# EAGLE schematic RPi_Extension_weight (EAGLE 7.6.0)
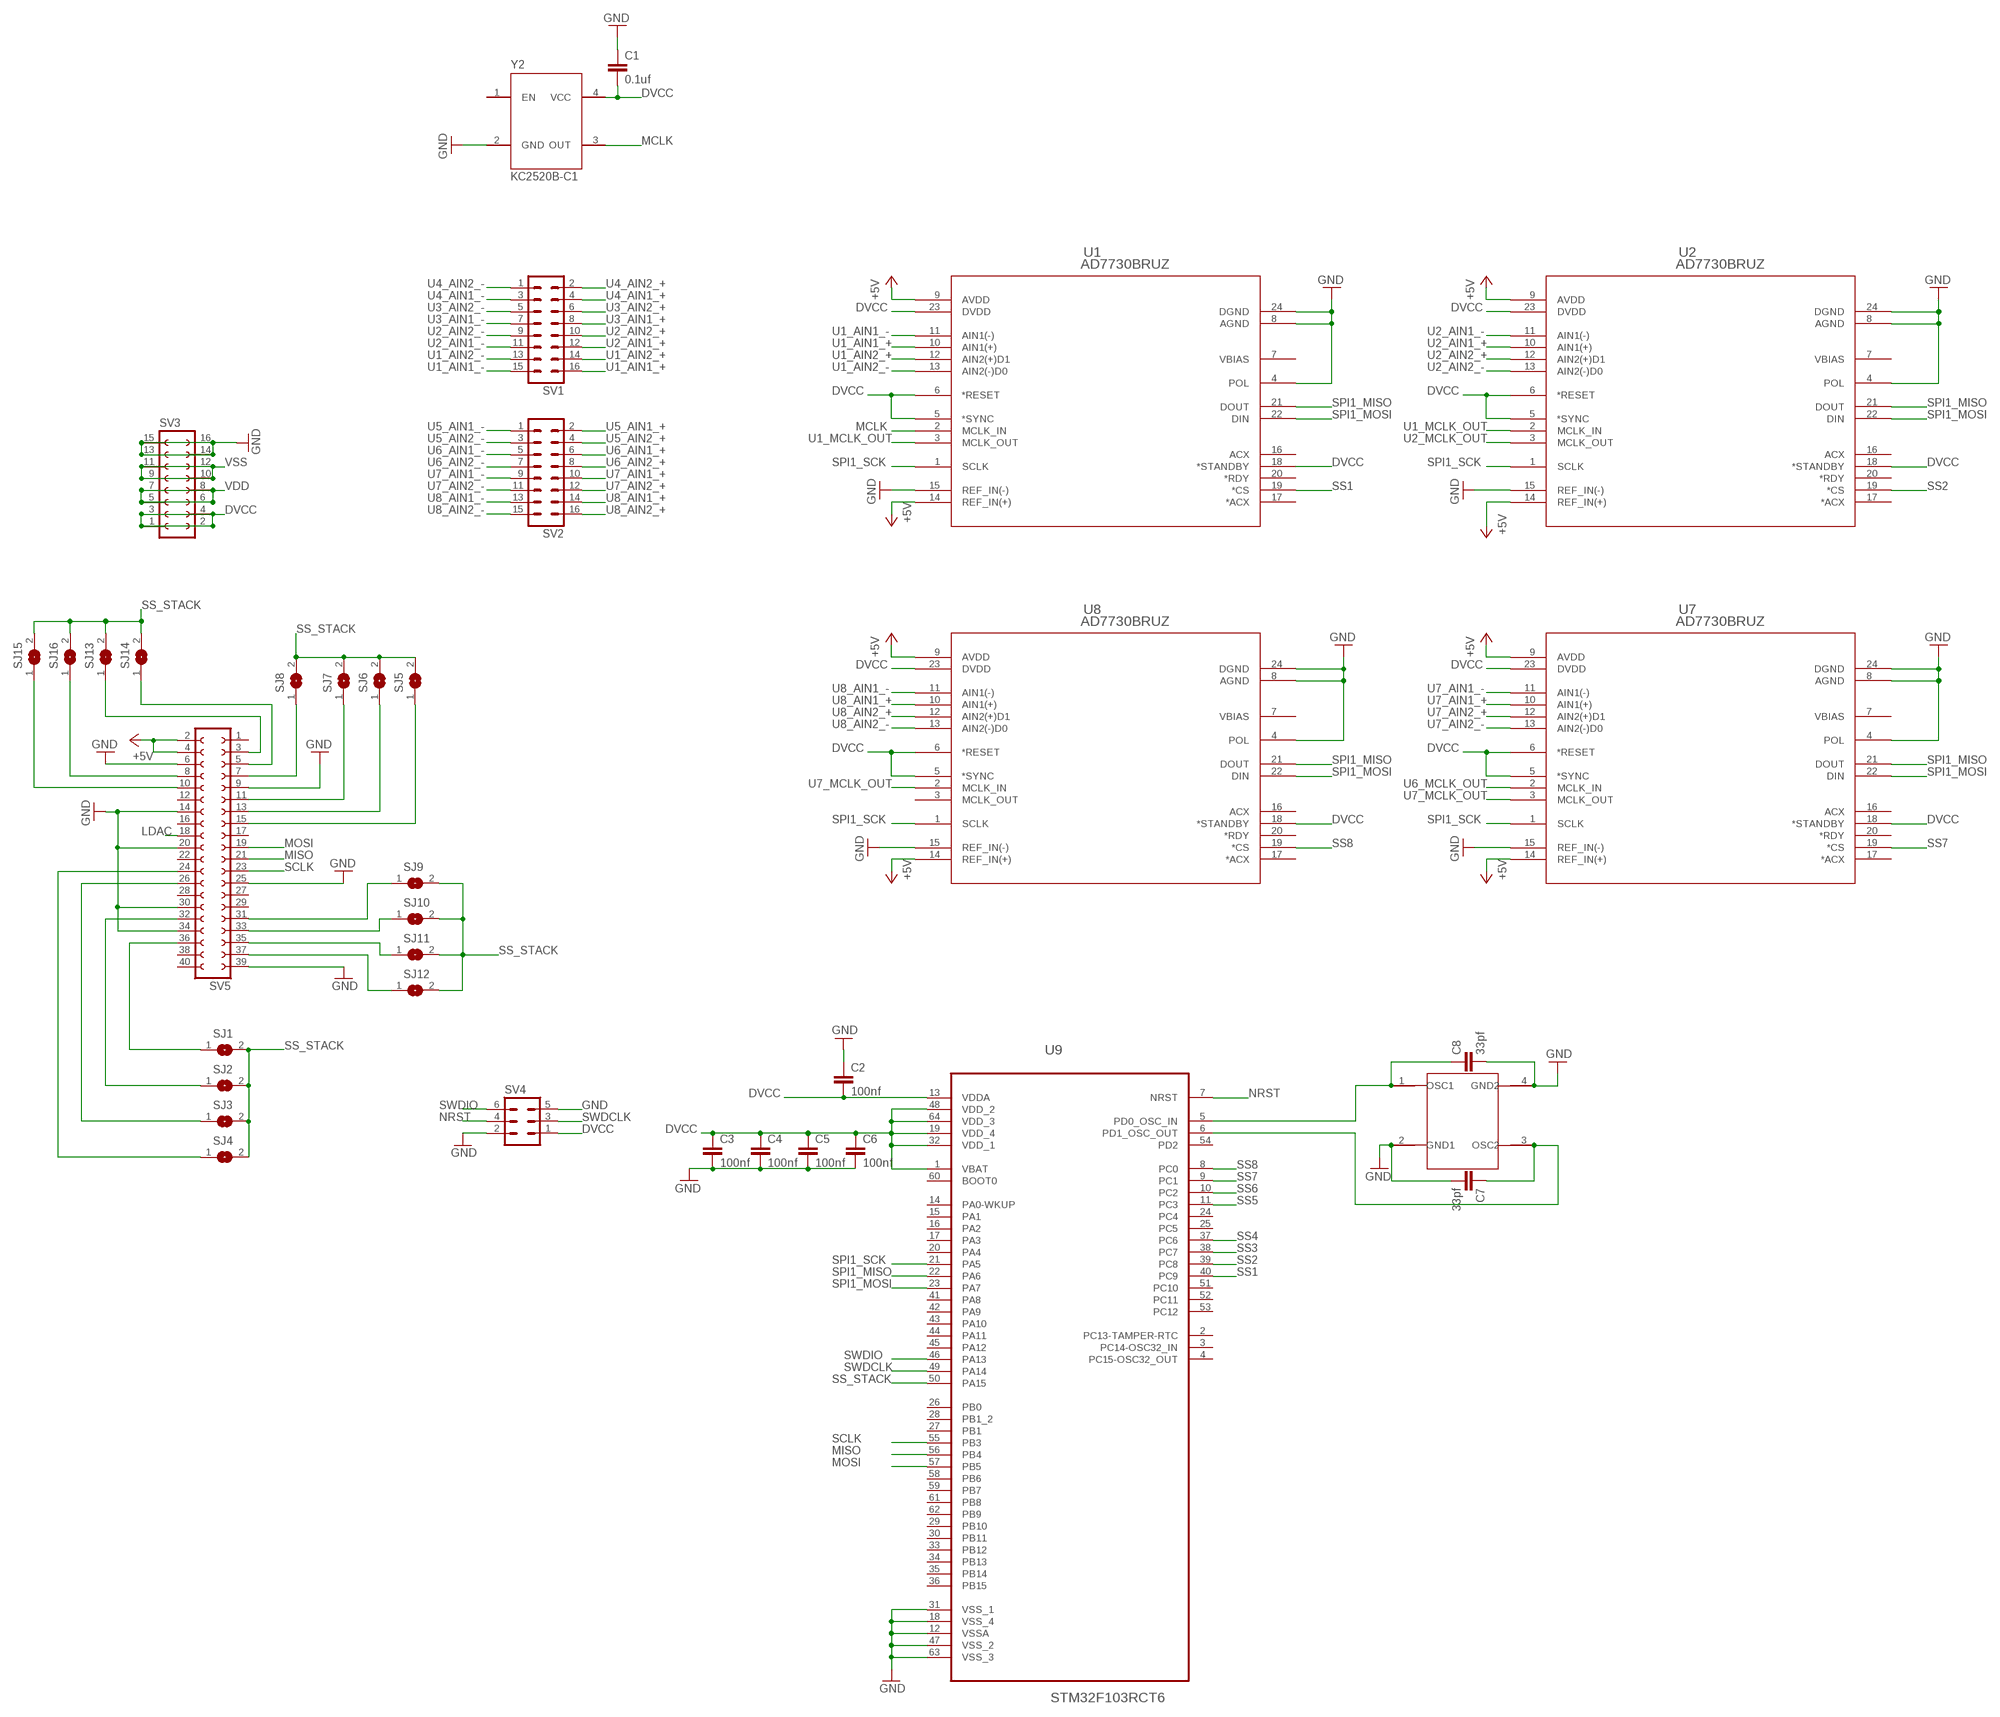
[diagram p0: schematic, sheet 1, part 1 of 2]
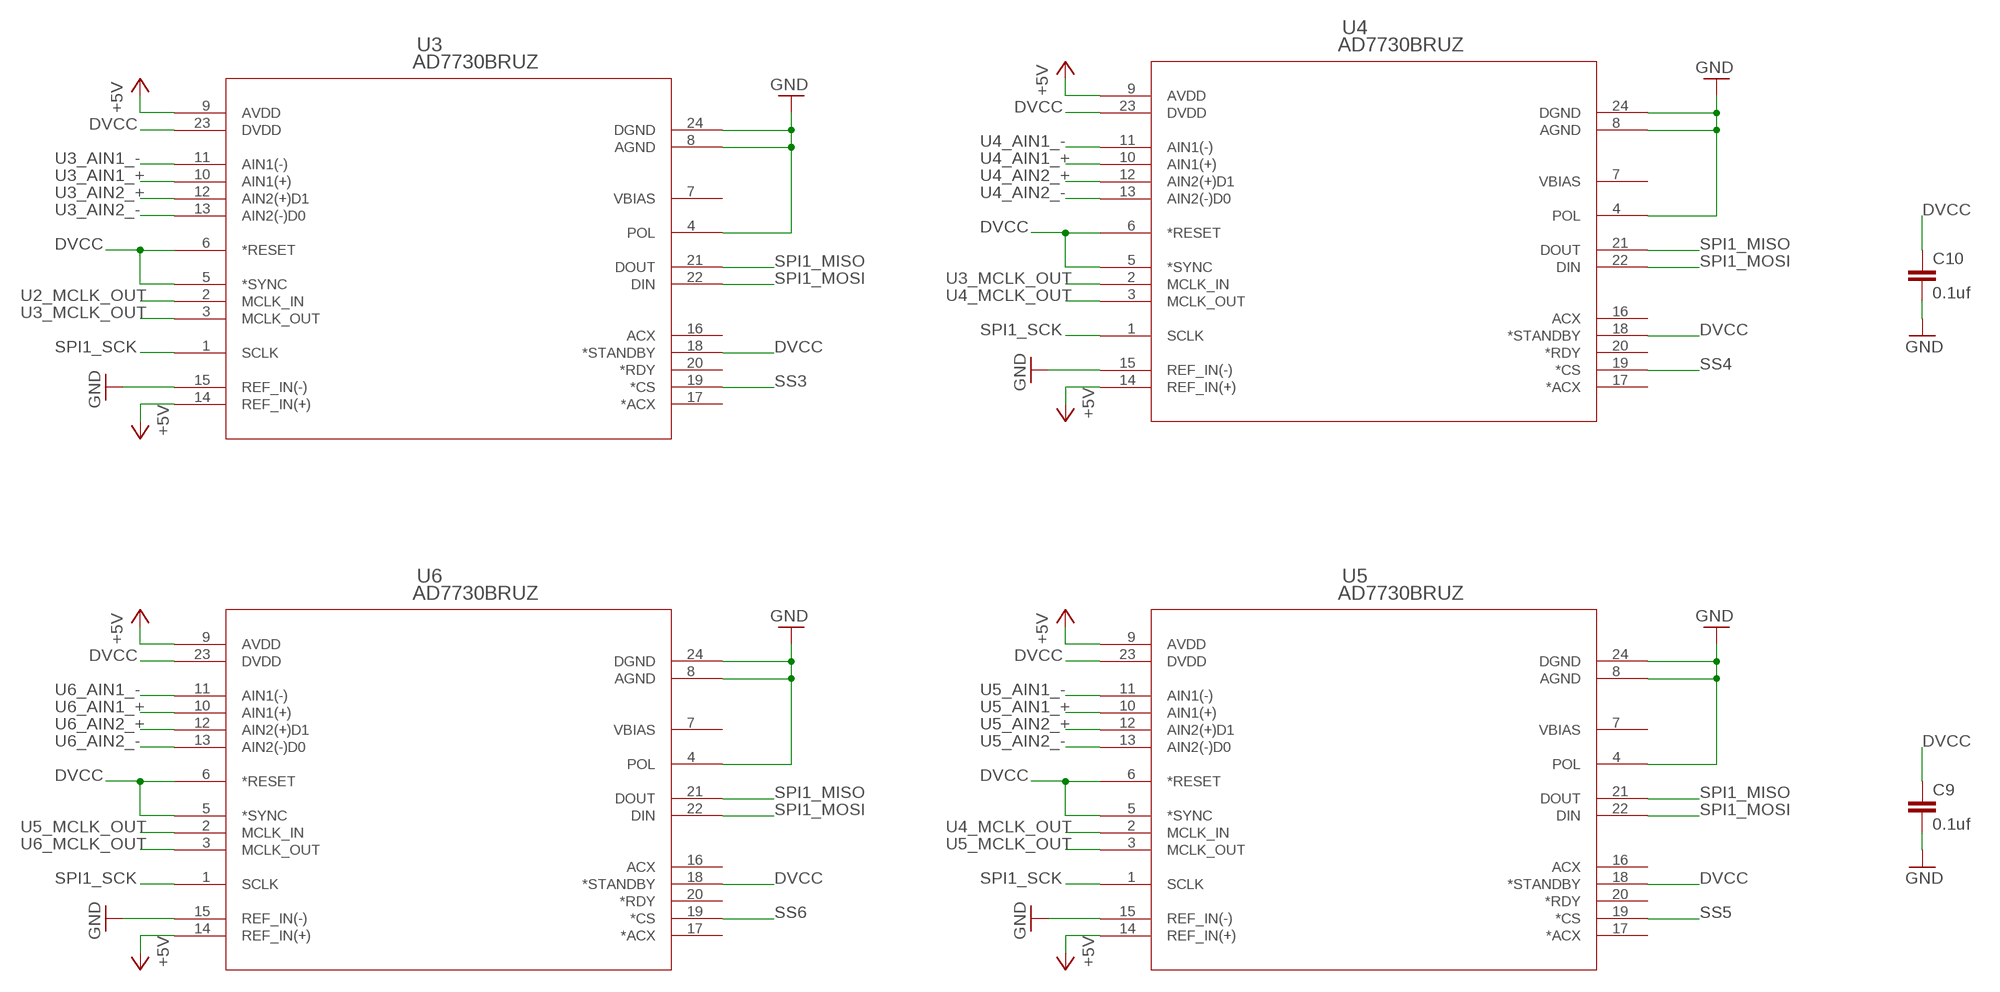
[diagram p1: schematic, sheet 1, part 2 of 2]

## Parts
C1  0.1uf  C-EUC0603  [C0603]
C2  100nf  C-EUC0603  [C0603]
C3  100nf  C-EUC0603  [C0603]
C4  100nf  C-EUC0603  [C0603]
C5  100nf  C-EUC0603  [C0603]
C6  100nf  C-EUC0603  [C0603]
C7  33pf  C-EUC0603  [C0603]
C8  33pf  C-EUC0603  [C0603]
C9  0.1uf  C-EUC0603  [C0603]
C10  0.1uf  C-EUC0603  [C0603]
SJ1  SJ  [SJ]
SJ2  SJ  [SJ]
SJ3  SJ  [SJ]
SJ4  SJ  [SJ]
SJ5  SJ  [SJ]
SJ6  SJ  [SJ]
SJ7  SJ  [SJ]
SJ8  SJ  [SJ]
SJ9  SJ  [SJ]
SJ10  SJ  [SJ]
SJ11  SJ  [SJ]
SJ12  SJ  [SJ]
SJ13  SJ  [SJ]
SJ14  SJ  [SJ]
SJ15  SJ  [SJ]
SJ16  SJ  [SJ]
SV1  MA08-2W  [MA08-2W]
SV2  MA08-2W  [MA08-2W]
SV3  FE08-2  [FE08-2]
SV4  MA03-2  [MA03-2]
SV5  FE20-2  [FE20-2]
U1  AD7730BRUZ  [RU_24]
U2  AD7730BRUZ  [RU_24]
U3  AD7730BRUZ  [RU_24]
U4  AD7730BRUZ  [RU_24]
U5  AD7730BRUZ  [RU_24]
U6  AD7730BRUZ  [RU_24]
U7  AD7730BRUZ  [RU_24]
U8  AD7730BRUZ  [RU_24]
U9  STM32F103RCT6  [QFP50P1200X1200X160-64N]
Y1  ABM3B  [ABM3B]
Y2  KC2520B-C1  [KC2520B-C1]

## Nets
+5V: SV5.2 SV5.4 U1.9(AVDD) U1.14(REF_IN(+)) U2.9(AVDD) U2.14(REF_IN(+)) U3.9(AVDD) U3.14(REF_IN(+)) U4.9(AVDD) U4.14(REF_IN(+)) U5.9(AVDD) U5.14(REF_IN(+)) U6.9(AVDD) U6.14(REF_IN(+)) U7.9(AVDD) U7.14(REF_IN(+)) U8.9(AVDD) U8.14(REF_IN(+))
DVCC: C1.2 C2.2 C3.1 C4.1 C5.1 C6.1 C9.1 C10.1 SV3.1 SV3.2 SV3.3 SV3.4 SV4.1 U1.5(*SYNC) U1.6(*RESET) U1.18(*STANDBY) U1.23(DVDD) U2.5(*SYNC) U2.6(*RESET) U2.18(*STANDBY) U2.23(DVDD) U3.5(*SYNC) U3.6(*RESET) U3.18(*STANDBY) U3.23(DVDD) U4.5(*SYNC) U4.6(*RESET) U4.18(*STANDBY) U4.23(DVDD) U5.5(*SYNC) U5.6(*RESET) U5.18(*STANDBY) U5.23(DVDD) U6.5(*SYNC) U6.6(*RESET) U6.18(*STANDBY) U6.23(DVDD) U7.5(*SYNC) U7.6(*RESET) U7.18(*STANDBY) U7.23(DVDD) U8.5(*SYNC) U8.6(*RESET) U8.18(*STANDBY) U8.23(DVDD) U9.1(VBAT) U9.13(VDDA) U9.19(VDD_4) U9.32(VDD_1) U9.48(VDD_2) U9.64(VDD_3) Y2.4(VCC)
GND: C1.1 C2.1 C3.2 C4.2 C5.2 C6.2 C7.2 C8.2 C9.2 C10.2 SV3.13 SV3.14 SV3.15 SV3.16 SV4.2 SV4.5 SV5.6 SV5.9 SV5.14 SV5.20 SV5.25 SV5.30 SV5.34 SV5.39 U1.4(POL) U1.8(AGND) U1.15(REF_IN(-)) U1.24(DGND) U2.4(POL) U2.8(AGND) U2.15(REF_IN(-)) U2.24(DGND) U3.4(POL) U3.8(AGND) U3.15(REF_IN(-)) U3.24(DGND) U4.4(POL) U4.8(AGND) U4.15(REF_IN(-)) U4.24(DGND) U5.4(POL) U5.8(AGND) U5.15(REF_IN(-)) U5.24(DGND) U6.4(POL) U6.8(AGND) U6.15(REF_IN(-)) U6.24(DGND) U7.4(POL) U7.8(AGND) U7.15(REF_IN(-)) U7.24(DGND) U8.4(POL) U8.8(AGND) U8.15(REF_IN(-)) U8.24(DGND) U9.12(VSSA) U9.18(VSS_4) U9.31(VSS_1) U9.47(VSS_2) U9.63(VSS_3) Y1.2(GND1) Y1.4(GND2) Y2.2(GND)
LDAC: SV5.18
MCLK: U1.2(MCLK_IN) Y2.3(OUT)
MISO: SV5.21 U9.56(PB4)
MOSI: SV5.19 U9.57(PB5)
N$1: SJ12.1 SV5.37
N$2: C8.1 U9.5(PD0_OSC_IN) Y1.1(OSC1)
N$3: C7.1 U9.6(PD1_OSC_OUT) Y1.3(OSC2)
N$4: SJ11.1 SV5.35
N$5: SJ10.1 SV5.33
N$6: SJ9.1 SV5.31
N$7: SJ16.1 SV5.8
N$8: SJ15.1 SV5.10
N$9: SJ13.1 SV5.3
N$10: SJ14.1 SV5.5
N$20: SJ1.1 SV5.36
N$21: SJ8.1 SV5.7
N$22: SJ2.1 SV5.32
N$23: SJ3.1 SV5.26
N$24: SJ4.1 SV5.24
N$25: SJ7.1 SV5.11
N$26: SJ6.1 SV5.13
N$27: SJ5.1 SV5.15
NRST: SV4.4 U9.7(NRST)
SCLK: SV5.23 U9.55(PB3)
SPI1_MISO: U1.21(DOUT) U2.21(DOUT) U3.21(DOUT) U4.21(DOUT) U5.21(DOUT) U6.21(DOUT) U7.21(DOUT) U8.21(DOUT) U9.22(PA6)
SPI1_MOSI: U1.22(DIN) U2.22(DIN) U3.22(DIN) U4.22(DIN) U5.22(DIN) U6.22(DIN) U7.22(DIN) U8.22(DIN) U9.23(PA7)
SPI1_SCK: U1.1(SCLK) U2.1(SCLK) U3.1(SCLK) U4.1(SCLK) U5.1(SCLK) U6.1(SCLK) U7.1(SCLK) U8.1(SCLK) U9.21(PA5)
SS1: U1.19(*CS) U9.40(PC9)
SS2: U2.19(*CS) U9.39(PC8)
SS3: U3.19(*CS) U9.38(PC7)
SS4: U4.19(*CS) U9.37(PC6)
SS5: U5.19(*CS) U9.11(PC3)
SS6: U6.19(*CS) U9.10(PC2)
SS7: U7.19(*CS) U9.9(PC1)
SS8: U8.19(*CS) U9.8(PC0)
SS_STACK: SJ1.2 SJ2.2 SJ3.2 SJ4.2 SJ5.2 SJ6.2 SJ7.2 SJ8.2 SJ9.2 SJ10.2 SJ11.2 SJ12.2 SJ13.2 SJ14.2 SJ15.2 SJ16.2 U9.50(PA15)
SWDCLK: SV4.3 U9.49(PA14)
SWDIO: SV4.6 U9.46(PA13)
U1_AIN1_+: SV1.16 U1.10(AIN1(+))
U1_AIN1_-: SV1.15 U1.11(AIN1(-))
U1_AIN2_+: SV1.14 U1.12(AIN2(+)D1)
U1_AIN2_-: SV1.13 U1.13(AIN2(-)D0)
U1_MCLK_OUT: U1.3(MCLK_OUT) U2.2(MCLK_IN)
U2_AIN1_+: SV1.12 U2.10(AIN1(+))
U2_AIN1_-: SV1.11 U2.11(AIN1(-))
U2_AIN2_+: SV1.10 U2.12(AIN2(+)D1)
U2_AIN2_-: SV1.9 U2.13(AIN2(-)D0)
U2_MCLK_OUT: U2.3(MCLK_OUT) U3.2(MCLK_IN)
U3_AIN1_+: SV1.8 U3.10(AIN1(+))
U3_AIN1_-: SV1.7 U3.11(AIN1(-))
U3_AIN2_+: SV1.6 U3.12(AIN2(+)D1)
U3_AIN2_-: SV1.5 U3.13(AIN2(-)D0)
U3_MCLK_OUT: U3.3(MCLK_OUT) U4.2(MCLK_IN)
U4_AIN1_+: SV1.4 U4.10(AIN1(+))
U4_AIN1_-: SV1.3 U4.11(AIN1(-))
U4_AIN2_+: SV1.2 U4.12(AIN2(+)D1)
U4_AIN2_-: SV1.1 U4.13(AIN2(-)D0)
U4_MCLK_OUT: U4.3(MCLK_OUT) U5.2(MCLK_IN)
U5_AIN1_+: SV2.2 U5.10(AIN1(+))
U5_AIN1_-: SV2.1 U5.11(AIN1(-))
U5_AIN2_+: SV2.4 U5.12(AIN2(+)D1)
U5_AIN2_-: SV2.3 U5.13(AIN2(-)D0)
U5_MCLK_OUT: U5.3(MCLK_OUT) U6.2(MCLK_IN)
U6_AIN1_+: SV2.6 U6.10(AIN1(+))
U6_AIN1_-: SV2.5 U6.11(AIN1(-))
U6_AIN2_+: SV2.8 U6.12(AIN2(+)D1)
U6_AIN2_-: SV2.7 U6.13(AIN2(-)D0)
U6_MCLK_OUT: U6.3(MCLK_OUT) U7.2(MCLK_IN)
U7_AIN1_+: SV2.10 U7.10(AIN1(+))
U7_AIN1_-: SV2.9 U7.11(AIN1(-))
U7_AIN2_+: SV2.12 U7.12(AIN2(+)D1)
U7_AIN2_-: SV2.11 U7.13(AIN2(-)D0)
U7_MCLK_OUT: U7.3(MCLK_OUT) U8.2(MCLK_IN)
U8_AIN1_+: SV2.14 U8.10(AIN1(+))
U8_AIN1_-: SV2.13 U8.11(AIN1(-))
U8_AIN2_+: SV2.16 U8.12(AIN2(+)D1)
U8_AIN2_-: SV2.15 U8.13(AIN2(-)D0)
VDD: SV3.5 SV3.6 SV3.7 SV3.8
VSS: SV3.9 SV3.10 SV3.11 SV3.12
Unconnected: SV5.1 SV5.12 SV5.16 SV5.17 SV5.22 SV5.27 SV5.28 SV5.29 SV5.38 SV5.40 U1.7(VBIAS) U1.16(ACX) U1.17(*ACX) U1.20(*RDY) U2.7(VBIAS) U2.16(ACX) U2.17(*ACX) U2.20(*RDY) U3.7(VBIAS) U3.16(ACX) U3.17(*ACX) U3.20(*RDY) U4.7(VBIAS) U4.16(ACX) U4.17(*ACX) U4.20(*RDY) U5.7(VBIAS) U5.16(ACX) U5.17(*ACX) U5.20(*RDY) U6.7(VBIAS) U6.16(ACX) U6.17(*ACX) U6.20(*RDY) U7.7(VBIAS) U7.16(ACX) U7.17(*ACX) U7.20(*RDY) U8.3(MCLK_OUT) U8.7(VBIAS) U8.16(ACX) U8.17(*ACX) U8.20(*RDY) U9.2(PC13-TAMPER-RTC) U9.3(PC14-OSC32_IN) U9.4(PC15-OSC32_OUT) U9.14(PA0-WKUP) U9.15(PA1) U9.16(PA2) U9.17(PA3) U9.20(PA4) U9.24(PC4) U9.25(PC5) U9.26(PB0) U9.27(PB1) U9.28(PB1_2) U9.29(PB10) U9.30(PB11) U9.33(PB12) U9.34(PB13) U9.35(PB14) U9.36(PB15) U9.41(PA8) U9.42(PA9) U9.43(PA10) U9.44(PA11) U9.45(PA12) U9.51(PC10) U9.52(PC11) U9.53(PC12) U9.54(PD2) U9.58(PB6) U9.60(BOOT0) U9.61(PB8) U9.62(PB9) Y2.1(EN)

## Power pins joined to a net without a drawn wire
PB7: U9.59(PB7)

## Library data of the parts
C1-C10 = rcl:C-EU: CAPACITOR, European symbol
SJ1-SJ16 = jumper:SJ: SMD solder JUMPER
SV1 SV2 = con-lstb:MA08-2W: PIN HEADER; OC_FARNELL: unknown; OC_NEWARK: unknown
SV3 = con-lsta:FE08-2: FEMALE HEADER; OC_FARNELL: unknown; OC_NEWARK: unknown
SV4 = con-lstb:MA03-2: PIN HEADER; OC_FARNELL: unknown; OC_NEWARK: unknown
SV5 = con-lsta:FE20-2: FEMALE HEADER; OC_FARNELL: unknown; OC_NEWARK: unknown
U1-U8 = AD7730BRUZ:AD7730BRUZ
U9 = STM32F103RCT6:STM32F103RCT6: ARM-based 32-bit MCU; MPN: STM32F103RCT6; OC_FARNELL: 1624136; OC_NEWARK: 01P4099; PACKAGE: QFP-64; SUPPLIER: STMICROELECTRONICS
Y1 = ABM3B:ABM3B
Y2 = kc2520b_c1:KC2520B-C1